# EAGLE design 1 (EAGLE 7.6.0)

## Sheet 1 of 5
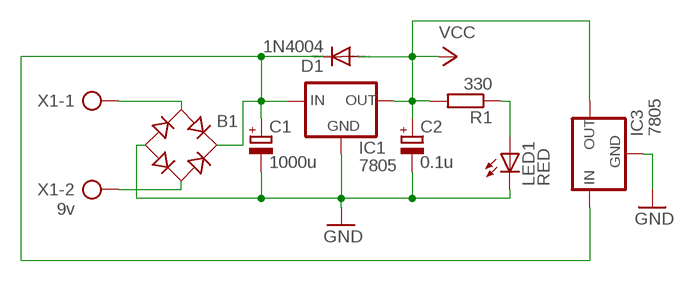
[diagram p0: schematic, sheet 1]

### Parts
B1  RB1A  [RB1A]
C1  1000u  CPOL-EUE3.5-8  [E3,5-8]
C2  0.1u  CPOL-EUE2-5  [E2-5]
D1  1N4004  [DO41-10]
IC1  7805  78XXS  [78XXS]
IC3  7805  78XXS  [78XXS]
LED1  RED  LED5MM  [LED5MM]
R1  330  R-EU_0204/7  [0204/7]
X1  9v  AK500/2  [AK500/2]

### Nets
GND: B1.- C1.- C2.- IC1.GND IC3.GND LED1.K(C) ; also sheet 2,3,4,5
N$1: B1.AC1 X1.1
N$2: B1.AC2 X1.2
N$3: B1.+ C1.+ D1.C IC1.IN IC3.IN
N$5: LED1.A R1.1
VCC: C2.+ D1.A IC1.OUT IC3.OUT R1.2 ; also sheet 2,3,4,5

## Sheet 2 of 5
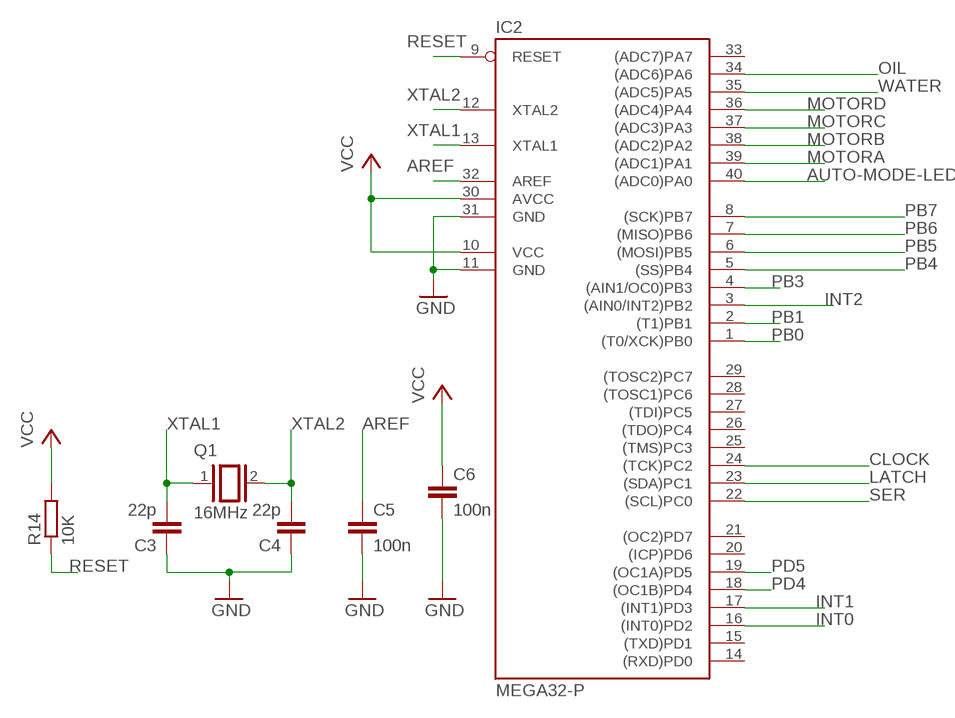
[diagram p1: schematic, sheet 2]

### Parts
C3  22p  C-EU025-024X044  [C025-024X044]
C4  22p  C-EU025-024X044  [C025-024X044]
C5  100n  C-EU025-024X044  [C025-024X044]
C6  100n  C-EU025-024X044  [C025-024X044]
IC2  MEGA32-P  [DIL40]
Q1  16MHz  XTAL  [Q]
R14  10K  R-EU_0204/7  [0204/7]

### Nets
AREF: C5.1 IC2.32(AREF)
AUTO-MODE-LED: IC2.40((ADC0)PA0) ; also sheet 5
CLOCK: IC2.24((TCK)PC2) ; also sheet 3
GND: C3.1 C4.1 C5.2 C6.2 IC2.11(GND) IC2.31(GND) ; also sheet 1,3,4,5
INT0: IC2.16((INT0)PD2) ; also sheet 4
INT1: IC2.17((INT1)PD3) ; also sheet 4
INT2: IC2.3((AIN0/INT2)PB2) ; also sheet 4
LATCH: IC2.23((SDA)PC1) ; also sheet 3
MOTORA: IC2.39((ADC1)PA1) ; also sheet 5
MOTORB: IC2.38((ADC2)PA2) ; also sheet 5
MOTORC: IC2.37((ADC3)PA3) ; also sheet 5
MOTORD: IC2.36((ADC4)PA4) ; also sheet 5
OIL: IC2.34((ADC6)PA6) ; also sheet 5
PB0: IC2.1((T0/XCK)PB0) ; also sheet 4
PB1: IC2.2((T1)PB1) ; also sheet 4
PB3: IC2.4((AIN1/OC0)PB3) ; also sheet 4
PB4: IC2.5((SS)PB4) ; also sheet 4
PB5: IC2.6((MOSI)PB5) ; also sheet 4
PB6: IC2.7((MISO)PB6) ; also sheet 4
PB7: IC2.8((SCK)PB7) ; also sheet 4
PD4: IC2.18((OC1B)PD4) ; also sheet 4
PD5: IC2.19((OC1A)PD5) ; also sheet 4
RESET: IC2.9(RESET) R14.1 ; also sheet 4
SER: IC2.22((SCL)PC0) ; also sheet 3
VCC: C6.1 IC2.10(VCC) IC2.30(AVCC) R14.2 ; also sheet 1,3,4,5
WATER: IC2.35((ADC5)PA5) ; also sheet 5
XTAL1: C3.2 IC2.13(XTAL1) Q1.1
XTAL2: C4.2 IC2.12(XTAL2) Q1.2
Unconnected: IC2.14((RXD)PD0) IC2.15((TXD)PD1) IC2.20((ICP)PD6) IC2.21((OC2)PD7) IC2.25((TMS)PC3) IC2.26((TDO)PC4) IC2.27((TDI)PC5) IC2.28((TOSC1)PC6) IC2.29((TOSC2)PC7) IC2.33((ADC7)PA7)

## Sheet 3 of 5
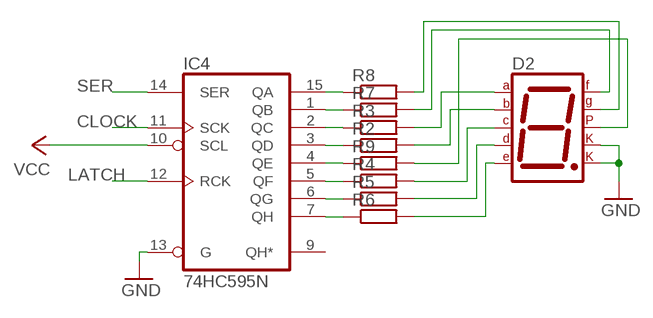
[diagram p2: schematic, sheet 3]

### Parts
D2  7SEG-CK  [7SEG-13]
IC4  74HC595N  [DIL16]
R2  R-EU_0204/7  [0204/7]
R3  R-EU_0204/7  [0204/7]
R4  R-EU_0204/7  [0204/7]
R5  R-EU_0204/7  [0204/7]
R6  R-EU_0204/7  [0204/7]
R7  R-EU_0204/7  [0204/7]
R8  R-EU_0204/7  [0204/7]
R9  R-EU_0204/7  [0204/7]

### Nets
CLOCK: IC4.11(SCK) ; also sheet 2
GND: D2.3(CK1) D2.8(CK2) IC4.13(G) ; also sheet 1,2,4,5
LATCH: IC4.12(RCK) ; also sheet 2
N$4: D2.7(A) R3.2
N$7: D2.6(B) R2.2
N$8: D2.9(F) R7.2
N$9: D2.2(D) R5.2
N$10: D2.1(E) R6.2
N$11: D2.10(G) R8.2
N$13: D2.5(DP) R9.2
N$14: IC4.15(QA) R8.1
N$15: IC4.4(QE) R9.1
N$31: IC4.1(QB) R7.1
N$69: IC4.2(QC) R3.1
N$70: IC4.3(QD) R2.1
N$71: IC4.5(QF) R4.1
N$72: IC4.6(QG) R5.1
N$73: IC4.7(QH) R6.1
N$75: D2.4(C) R4.2
SER: IC4.14(SER) ; also sheet 2
VCC: IC4.10(SCL) ; also sheet 1,2,4,5
Unconnected: IC4.9(QH*)

## Sheet 4 of 5
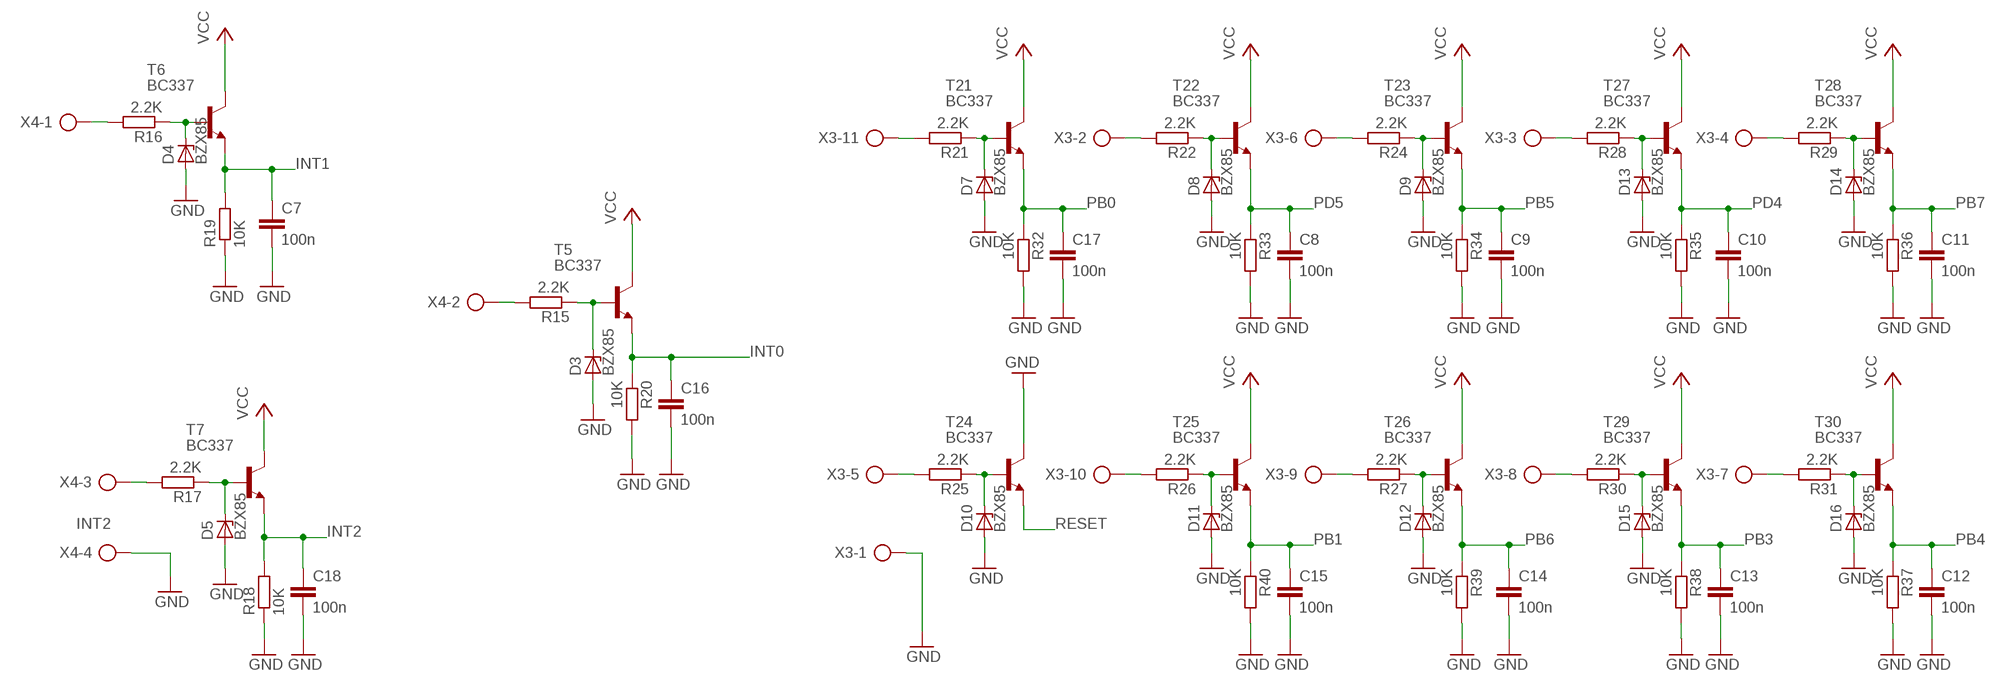
[diagram p3: schematic, sheet 4]

### Parts
C7  100n  C-EU025-024X044  [C025-024X044]
C8  100n  C-EU025-024X044  [C025-024X044]
C9  100n  C-EU025-024X044  [C025-024X044]
C10  100n  C-EU025-024X044  [C025-024X044]
C11  100n  C-EU025-024X044  [C025-024X044]
C12  100n  C-EU025-024X044  [C025-024X044]
C13  100n  C-EU025-024X044  [C025-024X044]
C14  100n  C-EU025-024X044  [C025-024X044]
C15  100n  C-EU025-024X044  [C025-024X044]
C16  100n  C-EU025-024X044  [C025-024X044]
C17  100n  C-EU025-024X044  [C025-024X044]
C18  100n  C-EU025-024X044  [C025-024X044]
D3  BZX85  [DO41Z10]
D4  BZX85  [DO41Z10]
D5  BZX85  [DO41Z10]
D7  BZX85  [DO41Z10]
D8  BZX85  [DO41Z10]
D9  BZX85  [DO41Z10]
D10  BZX85  [DO41Z10]
D11  BZX85  [DO41Z10]
D12  BZX85  [DO41Z10]
D13  BZX85  [DO41Z10]
D14  BZX85  [DO41Z10]
D15  BZX85  [DO41Z10]
D16  BZX85  [DO41Z10]
R15  2.2K  R-EU_0207/10  [0207/10]
R16  2.2K  R-EU_0207/10  [0207/10]
R17  2.2K  R-EU_0207/10  [0207/10]
R18  10K  R-EU_0204/7  [0204/7]
R19  10K  R-EU_0204/7  [0204/7]
R20  10K  R-EU_0204/7  [0204/7]
R21  2.2K  R-EU_0207/10  [0207/10]
R22  2.2K  R-EU_0207/10  [0207/10]
R24  2.2K  R-EU_0207/10  [0207/10]
R25  2.2K  R-EU_0207/10  [0207/10]
R26  2.2K  R-EU_0207/10  [0207/10]
R27  2.2K  R-EU_0207/10  [0207/10]
R28  2.2K  R-EU_0207/10  [0207/10]
R29  2.2K  R-EU_0207/10  [0207/10]
R30  2.2K  R-EU_0207/10  [0207/10]
R31  2.2K  R-EU_0207/10  [0207/10]
R32  10K  R-EU_0204/7  [0204/7]
R33  10K  R-EU_0204/7  [0204/7]
R34  10K  R-EU_0204/7  [0204/7]
R35  10K  R-EU_0204/7  [0204/7]
R36  10K  R-EU_0204/7  [0204/7]
R37  10K  R-EU_0204/7  [0204/7]
R38  10K  R-EU_0204/7  [0204/7]
R39  10K  R-EU_0204/7  [0204/7]
R40  10K  R-EU_0204/7  [0204/7]
T5  BC337  [TO92]
T6  BC337  [TO92]
T7  BC337  [TO92]
T21  BC337  [TO92]
T22  BC337  [TO92]
T23  BC337  [TO92]
T24  BC337  [TO92]
T25  BC337  [TO92]
T26  BC337  [TO92]
T27  BC337  [TO92]
T28  BC337  [TO92]
T29  BC337  [TO92]
T30  BC337  [TO92]
X3  AK500/11  [AK500/11]
X4  AK500/4  [AK500/4]

### Nets
GND: C7.2 C8.2 C9.2 C10.2 C11.2 C12.2 C13.2 C14.2 C15.2 C16.2 C17.2 C18.2 D3.A D4.A D5.A D7.A D8.A D9.A D10.A D11.A D12.A D13.A D14.A D15.A D16.A R18.1 R19.1 R20.2 R32.2 R33.2 R34.2 R35.2 R36.2 R37.2 R38.2 R39.2 R40.2 T24.3(C) X3.1 X4.4 ; also sheet 1,2,3,5
INT0: C16.1 R20.1 T5.1(E) ; also sheet 2
INT1: C7.1 R19.2 T6.1(E) ; also sheet 2
INT2: C18.1 R18.2 T7.1(E) ; also sheet 2
N$6: R21.2 X3.11
N$16: D7.C R21.1 T21.2(B)
N$17: D8.C R22.1 T22.2(B)
N$25: D9.C R24.1 T23.2(B)
N$26: D10.C R25.1 T24.2(B)
N$27: D11.C R26.1 T25.2(B)
N$28: D12.C R27.1 T26.2(B)
N$29: D3.C R15.1 T5.2(B)
N$30: D5.C R17.1 T7.2(B)
N$32: R16.2 X4.1
N$33: R17.2 X4.3
N$34: R15.2 X4.2
N$40: D13.C R28.1 T27.2(B)
N$41: D14.C R29.1 T28.2(B)
N$42: D15.C R30.1 T29.2(B)
N$43: D16.C R31.1 T30.2(B)
N$46: R25.2 X3.5
N$47: R26.2 X3.10
N$48: R27.2 X3.9
N$49: R30.2 X3.8
N$50: R31.2 X3.7
N$51: R29.2 X3.4
N$52: R28.2 X3.3
N$53: R24.2 X3.6
N$54: R22.2 X3.2
N$68: D4.C R16.1 T6.2(B)
PB0: C17.1 R32.1 T21.1(E) ; also sheet 2
PB1: C15.1 R40.1 T25.1(E) ; also sheet 2
PB3: C13.1 R38.1 T29.1(E) ; also sheet 2
PB4: C12.1 R37.1 T30.1(E) ; also sheet 2
PB5: C9.1 R34.1 T23.1(E) ; also sheet 2
PB6: C14.1 R39.1 T26.1(E) ; also sheet 2
PB7: C11.1 R36.1 T28.1(E) ; also sheet 2
PD4: C10.1 R35.1 T27.1(E) ; also sheet 2
PD5: C8.1 R33.1 T22.1(E) ; also sheet 2
RESET: T24.1(E) ; also sheet 2
VCC: T5.3(C) T6.3(C) T7.3(C) T21.3(C) T22.3(C) T23.3(C) T25.3(C) T26.3(C) T27.3(C) T28.3(C) T29.3(C) T30.3(C) ; also sheet 1,2,3,5

## Sheet 5 of 5
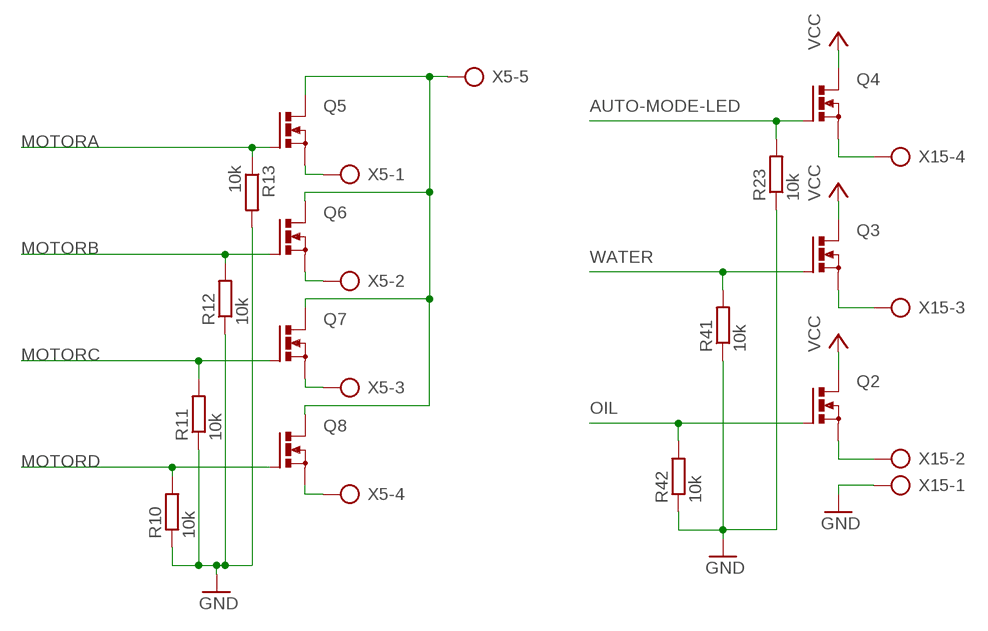
[diagram p4: schematic, sheet 5]

### Parts
Q2  N-MOSFET-SO8S  [SO-08]
Q3  N-MOSFET-SO8S  [SO-08]
Q4  N-MOSFET-SO8S  [SO-08]
Q5  N-MOSFET-SO8S  [SO-08]
Q6  N-MOSFET-SO8S  [SO-08]
Q7  N-MOSFET-SO8S  [SO-08]
Q8  N-MOSFET-SO8S  [SO-08]
R10  10k  R-EU_0204/7  [0204/7]
R11  10k  R-EU_0204/7  [0204/7]
R12  10k  R-EU_0204/7  [0204/7]
R13  10k  R-EU_0204/7  [0204/7]
R23  10k  R-EU_0204/7  [0204/7]
R41  10k  R-EU_0204/7  [0204/7]
R42  10k  R-EU_0204/7  [0204/7]
X5  AK500/5  [AK500/5]
X15  AK500/4  [AK500/4]

### Nets
AUTO-MODE-LED: Q4.4(G) R23.2 ; also sheet 2
GND: R10.1 R11.1 R12.1 R13.2 R23.1 R41.1 R42.1 X15.1 ; also sheet 1,2,3,4
MOTORA: Q5.4(G) R13.1 ; also sheet 2
MOTORB: Q6.4(G) R12.2 ; also sheet 2
MOTORC: Q7.4(G) R11.2 ; also sheet 2
MOTORD: Q8.4(G) R10.2 ; also sheet 2
N$18: Q5.1(S) Q5.2(S) Q5.3(S) X5.1
N$19: Q6.1(S) Q6.2(S) Q6.3(S) X5.2
N$20: Q7.1(S) Q7.2(S) Q7.3(S) X5.3
N$21: Q8.1(S) Q8.2(S) Q8.3(S) X5.4
N$22: Q4.1(S) Q4.2(S) Q4.3(S) X15.4
N$23: Q3.1(S) Q3.2(S) Q3.3(S) X15.3
N$24: Q2.1(S) Q2.2(S) Q2.3(S) X15.2
N$39: Q5.5(D) Q5.6(D) Q5.7(D) Q5.8(D) Q6.5(D) Q6.6(D) Q6.7(D) Q6.8(D) Q7.5(D) Q7.6(D) Q7.7(D) Q7.8(D) Q8.5(D) Q8.6(D) Q8.7(D) Q8.8(D) X5.5
OIL: Q2.4(G) R42.2 ; also sheet 2
VCC: Q2.5(D) Q2.6(D) Q2.7(D) Q2.8(D) Q3.5(D) Q3.6(D) Q3.7(D) Q3.8(D) Q4.5(D) Q4.6(D) Q4.7(D) Q4.8(D) ; also sheet 1,2,3,4
WATER: Q3.4(G) R41.2 ; also sheet 2

## Power pins joined to a net without a drawn wire
GND: IC4.8(GND)
VCC: IC4.16(VCC)

## Library data of the parts
B1 = rectifier:RB1A: RECTIFIER 1 A
C1 C2 = rcl:CPOL-EU: POLARIZED CAPACITOR, European symbol
C3-C18 = rcl:C-EU: CAPACITOR, European symbol
D1 = diode:1N4004: DIODE general purpose rectifier, 1 A
D2 = special:7SEG-CK: 7-segment DISPLAY single cathode, 13 mm
D3-D5 D7-D16 = diode:BZX85: Z DIODE
IC1 IC3 = v-reg:78XXS: VOLTAGE REGULATOR
IC2 = atmel:MEGA32-P: MICROCONTROLLER 32 Kbytes FLASH 2 Kbytes SRAM 1 Kbytes EEPROM USART 8-channel 10 bit ADC Source: www.atmel.com .. doc2503.pdf; MPN: ATMEGA32-16PU; OC_FARNELL: 1661729; OC_NEWARK: 51P1794
IC4 = 74xx-eu:74*595: 8-bit SHIFT REGISTER, output latch
LED1 = led:LED: LED OSRAM: - CHIPLED LG R971, LG N971, LY N971, LG Q971, LY Q971, LO R971, LY R971 LH N974, LH R974 LS Q976, LO Q976, LY Q976 LO Q996 - Hyper CHIPLED LW Q18S LB Q993, LB Q99A, LB R99A - SideLED LS A670, LO A670, LY A670, LG A670, LP A670 LB A673, LV A673, LT A673, LW A673 LH A674 LY A675 LS A676, LA A676, LO A676, LY A676, LW A676 LS A679, LY A679, LG A679 - Hyper Micro SIDELED® LS Y876, LA Y876, LO Y876, LY Y876 LT Y87S - SmartLED LW L88C, LW L88S LB L89C, LB L89S, LG L890 LS L89K, LO L89K, LY L89K LS L896, LA L896, LO L896, LY L896 - TOPLED LS T670, LO T670, LY T670, LG T670, LP T670 LSG T670, LSP T670, LSY T670, LOP T670, LYG T670 LG T671, LOG T671, LSG T671 LB T673, LV T673, LT T673, LW T673 LH T674 LS T676, LA T676, LO T676, LY T676, LB T676, LH T676, LSB T676, LW T676 LB T67C, LV T67C, LT T67C, LS T67K, LO T67K, LY T67K, LW E67C LS E67B, LA E67B, LO E67B, LY E67B, LB E67C, LV E67C, LT E67C LW T67C LS T679, LY T679, LG T679 LS T770, LO T770, LY T770, LG T770, LP T770 LB T773, LV T773, LT T773, LW T773 LH T774 LS E675, LA E675, LY E675, LS T675 LS T776, LA T776, LO T776, LY T776, LB T776 LHGB T686 LT T68C, LB T68C - Hyper Mini TOPLED® LB M676 - Mini TOPLED Santana® LG M470 LS M47K, LO M47K, LY M47K Source: http://www.osram.convergy.de LUXEON: - LUMILED® LXK2-PW12-R00, LXK2-PW12-S00, LXK2-PW14-U00, LXK2-PW14-V00 LXK2-PM12-R00, LXK2-PM12-S00, LXK2-PM14-U00 LXK2-PE12-Q00, LXK2-PE12-R00, LXK2-PE12-S00, LXK2-PE14-T00, LXK2-PE14-U00 LXK2-PB12-K00, LXK2-PB12-L00, LXK2-PB12-M00, LXK2-PB14-N00, LXK2-PB14-P00, LXK2-PB14-Q00 LXK2-PR12-L00, LXK2-PR12-M00, LXK2-PR14-Q00, LXK2-PR14-R00 LXK2-PD12-Q00, LXK2-PD12-R00, LXK2-PD12-S00 LXK2-PH12-R00, LXK2-PH12-S00 LXK2-PL12-P00, LXK2-PL12-Q00, LXK2-PL12-R00 Source: www.luxeon.com KINGBRIGHT: KA-3528ASYC Source: www.kingbright.com
Q1 = special:XTAL: CRYSTAL
Q2-Q8 = transistor-power:N-MOSFET-SO8: N-Channel MOSFET Example: FDS7760A; N-Channel Logic Level PowerTrench® MOSFET FDS2572; N-Channel UltraFET® Trench MOSFET Source: www.fairchildsemi.com
R1-R42 = rcl:R-EU_: RESISTOR, European symbol
T5-T7 T21-T30 = transistor:BC337: NPN TRANSISTOR
X1 = con-ptr500:AK500/2: CONNECTOR; OC_FARNELL: unknown; OC_NEWARK: unknown
X3 = con-ptr500:AK500/11: CONNECTOR; OC_FARNELL: unknown; OC_NEWARK: unknown
X4 X15 = con-ptr500:AK500/4: CONNECTOR; OC_FARNELL: unknown; OC_NEWARK: unknown
X5 = con-ptr500:AK500/5: CONNECTOR; OC_FARNELL: unknown; OC_NEWARK: unknown

## Board
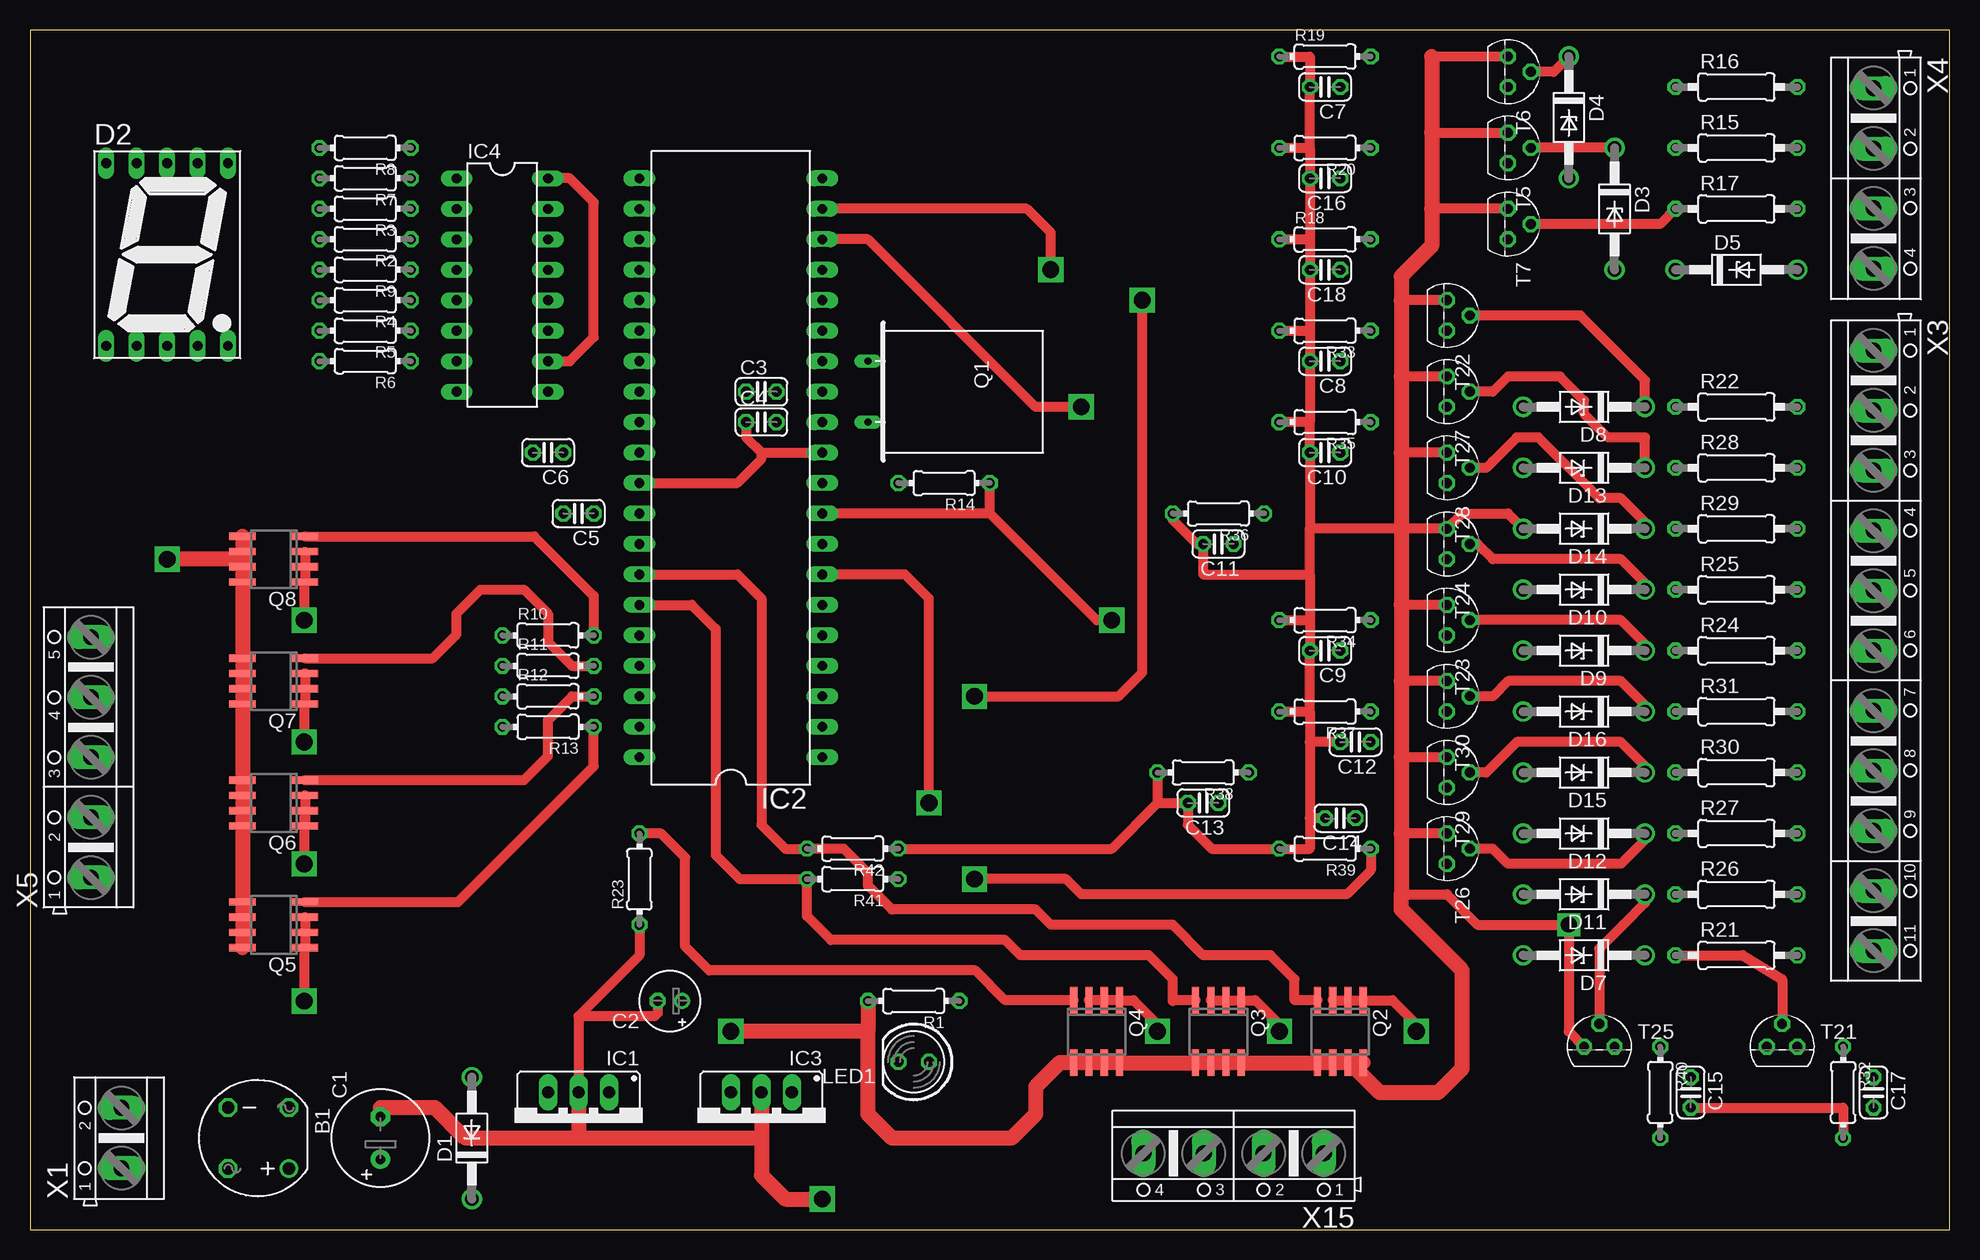
[diagram p5: board, top side]
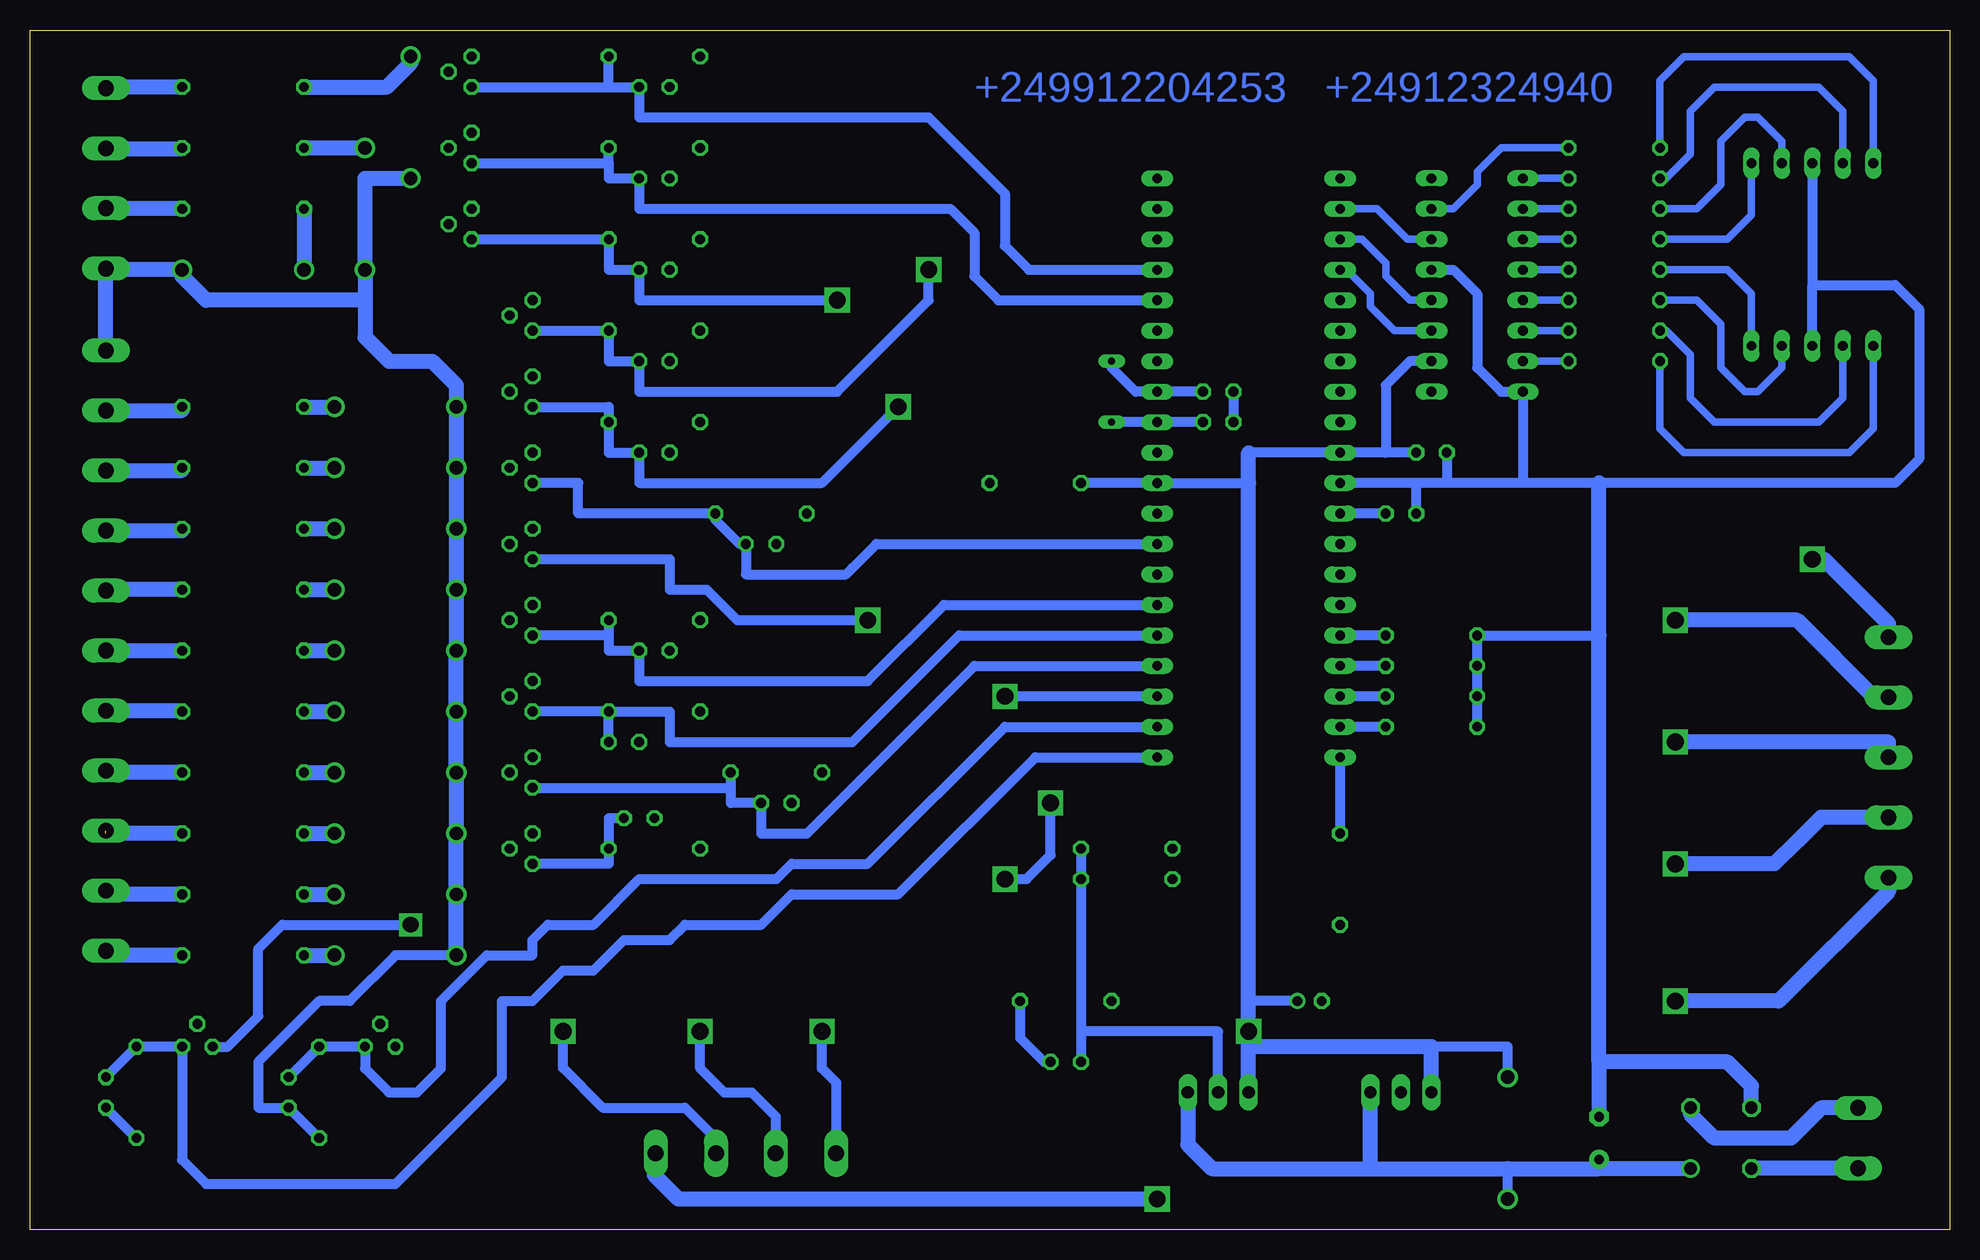
[diagram p6: board, bottom side, seen from below]

Size 160 x 100 mm. Coordinates in mm from the lower left corner, seen from the top.
Outline: 0,0 160,0 160,100 0,100 0,0
Copper layers (1*16): Top 0.035mm / dielectric 1.5mm / Bottom 0.035mm
Design rules "default": minimum track width 10mil, minimum drill 24mil, track to track 8mil, track to pad 8mil, pad to pad 8mil, via to via 8mil, smd to smd 8mil, copper to edge 40mil, drill to drill 8mil, minimum pad ring 10mil, minimum via ring 8mil, stop-mask expansion 4mil, vias tented up to drill 0mil, thermal gap 10mil

### Footprints (pad centres in the part's own frame; a part is rotated, then mirrored left to right if it is on the bottom)
RB1A = drill 1.016: + -2.54,2.54 | drill 1.016 octagon: - 2.54,-2.54; AC1 2.54,2.54; AC2 -2.54,-2.54
E3,5-8 = drill 0.813 pad 1.6: + -1.778,0 | drill 0.813 pad 1.6 octagon: - 1.778,0
E2-5 = drill 0.813 pad 1.27: + -1.016,0 | drill 0.813 pad 1.27 octagon: - 1.016,0
C025-024X044 = drill 0.813 octagon: 1 -1.27,0; 2 1.27,0
DO41-10 = drill 1.118: A 5.08,0; C -5.08,0
7SEG-13 = drill 0.813 long: 1 -5.08,-7.62; 2 -2.54,-7.62; 3 0,-7.62; 4 2.54,-7.62; 5 5.08,-7.62; 6 5.08,7.62; 7 2.54,7.62; 8 0,7.62; 9 -2.54,7.62; 10 -5.08,7.62
DO41Z10 = drill 1.118: A 5.08,0; C -5.08,0
78XXS = drill 1.016 long: GND 0,-2.54; IN -2.54,-2.54; OUT 2.54,-2.54
DIL40 = drill 0.813 long: 1 -24.13,-7.62; 2 -21.59,-7.62; 3 -19.05,-7.62; 4 -16.51,-7.62; 5 -13.97,-7.62; 6 -11.43,-7.62; 7 -8.89,-7.62; 8 -6.35,-7.62; 9 -3.81,-7.62; 10 -1.27,-7.62; 11 1.27,-7.62; 12 3.81,-7.62; 13 6.35,-7.62; 14 8.89,-7.62; 15 11.43,-7.62; 16 13.97,-7.62; 17 16.51,-7.62; 18 19.05,-7.62; 19 21.59,-7.62; 20 24.13,-7.62; 21 24.13,7.62; 22 21.59,7.62; 23 19.05,7.62; 24 16.51,7.62; 25 13.97,7.62; 26 11.43,7.62; 27 8.89,7.62; 28 6.35,7.62; 29 3.81,7.62; 30 1.27,7.62; 31 -1.27,7.62; 32 -3.81,7.62; 33 -6.35,7.62; 34 -8.89,7.62; 35 -11.43,7.62; 36 -13.97,7.62; 37 -16.51,7.62; 38 -19.05,7.62; 39 -21.59,7.62; 40 -24.13,7.62
DIL16 = drill 0.813 long: 1 -8.89,-3.81; 2 -6.35,-3.81; 3 -3.81,-3.81; 4 -1.27,-3.81; 5 1.27,-3.81; 6 3.81,-3.81; 7 6.35,-3.81; 8 8.89,-3.81; 9 8.89,3.81; 10 6.35,3.81; 11 3.81,3.81; 12 1.27,3.81; 13 -1.27,3.81; 14 -3.81,3.81; 15 -6.35,3.81; 16 -8.89,3.81
LED5MM = drill 0.813 octagon: A -1.27,0; K 1.27,0
Q = drill 0.61 long: 1 -2.54,-7.62; 2 2.54,-7.62
SO-08 = smd 0.6 x 2.2: 1 -1.905,-2.6; 2 -0.635,-2.6; 3 0.635,-2.6; 4 1.905,-2.6; 5 1.905,2.6; 6 0.635,2.6; 7 -0.635,2.6; 8 -1.905,2.6
0204/7 = drill 0.813 octagon: 1 -3.81,0; 2 3.81,0
0207/10 = drill 0.813 octagon: 1 -5.08,0; 2 5.08,0
TO92 = drill 0.813 octagon: 1 1.27,0; 2 0,1.905; 3 -1.27,0
AK500/2 = drill 1.321 long: 1 -2.515,0; 2 2.515,0
AK500/11 = drill 1.321 long: 1 -25.019,0; 2 -20.015,0; 3 -15.011,0; 4 -10.008,0; 5 -5.004,0; 6 0,0; 7 5.004,0; 8 10.008,0; 9 15.011,0; 10 20.015,0; 11 25.019,0
AK500/4 = drill 1.321 long: 1 -7.518,0; 2 -2.489,0; 3 2.489,0; 4 7.518,0
AK500/5 = drill 1.321 long: 1 -10.033,0; 2 -5.004,0; 3 0,0; 4 5.004,0; 5 10.008,0

### Placement (x,y rotation side)
B1  19.05,7.62 180 top
C1  29.21,7.62 90 top
C2  53.34,19.05 180 top
C3  60.96,69.85 0 top
C4  60.96,67.31 0 top
C5  45.72,59.69 180 top
C6  43.18,64.77 180 top
C7  107.95,95.25 180 top
C8  107.95,72.39 180 top
C9  107.95,48.26 180 top
C10  107.95,64.77 180 top
C11  99.06,57.15 180 top
C12  110.49,40.64 180 top
C13  97.79,35.56 180 top
C14  109.22,34.29 180 top
C15  138.43,11.43 270 top
C16  107.95,87.63 180 top
C17  153.67,11.43 270 top
C18  107.95,80.01 180 top
D1  36.83,7.62 90 top
D2  11.43,81.28 0 top
D3  132.08,85.09 270 top
D4  128.27,92.71 270 top
D5  142.24,80.01 0 top
D7  129.54,22.86 180 top
D8  129.54,68.58 180 top
D9  129.54,48.26 180 top
D10  129.54,53.34 180 top
D11  129.54,27.94 180 top
D12  129.54,33.02 180 top
D13  129.54,63.5 180 top
D14  129.54,58.42 180 top
D15  129.54,38.1 180 top
D16  129.54,43.18 180 top
IC1  45.72,8.89 180 top
IC2  58.42,63.5 90 top
IC3  60.96,8.89 180 top
IC4  39.37,78.74 270 top
LED1  73.66,13.97 180 top
Q1  77.47,69.85 270 top
Q2  109.22,16.51 180 top
Q3  99.06,16.51 180 top
Q4  88.9,16.51 180 top
Q5  20.32,25.4 90 top
Q6  20.32,35.56 90 top
Q7  20.32,45.72 90 top
Q8  20.32,55.88 90 top
R1  73.66,19.05 180 top
R2  27.94,82.55 180 top
R3  27.94,85.09 180 top
R4  27.94,77.47 180 top
R5  27.94,74.93 180 top
R6  27.94,72.39 180 top
R7  27.94,87.63 180 top
R8  27.94,90.17 180 top
R9  27.94,80.01 180 top
R10  43.18,49.53 0 top
R11  43.18,46.99 0 top
R12  43.18,44.45 0 top
R13  43.18,41.91 180 top
R14  76.2,62.23 180 top
R15  142.24,90.17 0 top
R16  142.24,95.25 0 top
R17  142.24,85.09 0 top
R18  107.95,82.55 0 top
R19  107.95,97.79 0 top
R20  107.95,90.17 180 top
R21  142.24,22.86 0 top
R22  142.24,68.58 0 top
R23  50.8,29.21 90 top
R24  142.24,48.26 0 top
R25  142.24,53.34 0 top
R26  142.24,27.94 0 top
R27  142.24,33.02 0 top
R28  142.24,63.5 0 top
R29  142.24,58.42 0 top
R30  142.24,38.1 0 top
R31  142.24,43.18 0 top
R32  151.13,11.43 270 top
R33  107.95,74.93 180 top
R34  107.95,50.8 180 top
R35  107.95,67.31 180 top
R36  99.06,59.69 180 top
R37  107.95,43.18 180 top
R38  97.79,38.1 180 top
R39  107.95,31.75 180 top
R40  135.89,11.43 270 top
R41  68.58,29.21 180 top
R42  68.58,31.75 180 top
T5  123.19,90.17 270 top
T6  123.19,96.52 270 top
T7  123.19,83.82 270 top
T21  146.05,15.24 0 top
T22  118.11,76.2 270 top
T23  118.11,50.8 270 top
T24  118.11,57.15 270 top
T25  130.81,15.24 0 top
T26  118.11,31.75 270 top
T27  118.11,69.85 270 top
T28  118.11,63.5 270 top
T29  118.11,38.1 270 top
T30  118.11,44.45 270 top
X1  7.62,7.62 90 top
X3  153.67,48.26 270 top
X4  153.67,87.63 270 top
X5  5.08,39.37 90 top
X15  100.33,6.35 180 top

### Tracks (layer width: path | path; a pad name or v marks a point on that pad's centre or on a via)
AREF
  Bottom 0.813: C5.1 IC2.32
AUTO-MODE-LED
  Top 0.813: Q4.4 81.28,19.11 78.8,21.59 56.61,21.59 54.61,23.59 54.61,31.02 52.61,33.02 R23.2
  Bottom 0.813: IC2.40 R23.2
CLOCK
  Bottom 0.61: IC2.24 50.26,80.01 48.26,78.01 48.26,76.93 46.26,74.93 IC4.11
GND  (via drill 1.4)
  Top 0.813: IC2.31 58.96,62.23 60.96,64.23 60.96,64.77 | 60.96,64.77 IC2.11 | C4.1 59.69,66.04 60.96,64.77 | R23.1 50.8,22.86 45.72,17.78 | 45.72,17.78 IC1.GND | R19.1 106.68,97.79 C7.2 106.68,90.17 | R20.2 106.68,90.17 | 106.68,90.17 C16.2 106.68,82.55 | R18.1 106.68,82.55 | 106.68,82.55 C18.2 106.68,74.93 | R33.2 106.68,74.93 | 106.68,74.93 C8.2 106.68,67.31 | 106.68,67.31 R35.2 | 106.68,67.31 C10.2 106.68,58.42 | R37.2 106.68,43.18 | 106.68,43.18 C9.2 106.68,50.8 | 106.68,54.61 106.68,58.42 | 106.68,58.42 T24.3 119.38,59.69 123.19,59.69 D14.A | R36.2 95.25,59.15 97.25,57.15 C11.2 97.79,54.61 106.68,54.61 | 106.68,54.61 106.68,50.8 | R34.2 106.68,50.8 | R38.2 93.98,35.56 | 93.98,35.56 C13.2 96.52,33.75 98.52,31.75 R39.2 106.68,31.75 106.68,34.29 | 106.68,43.18 106.68,40.64 | C12.2 106.68,40.64 | 106.68,40.64 106.68,34.29 | C14.2 106.68,34.29 | C15.2 151.13,10.16 R32.2 | C2.- 52.32,18.03 52.07,17.78 45.72,17.78 | R42.1 90.17,31.75 93.98,35.56
  Top 1.27: IC1.GND 45.72,7.62 | 45.72,7.62 36.29,7.62 33.75,10.16 29.21,10.16 C1.- | IC3.GND 60.96,7.62 | 60.96,7.62 45.72,7.62 | 60.96,7.62 60.96,4.54 62.96,2.54 v66.04,2.54
  Bottom 0.813: D2.8 11.43,78.74 | D2.3 11.43,78.74 | 11.43,78.74 4.54,78.74 2.54,76.74 2.54,64.23 4.54,62.23 29.21,62.23 35.56,62.23 | 35.56,62.23 41.91,62.23 | 41.91,62.23 44.45,62.23 | 44.45,62.23 IC2.31 | R13.2 R12.1 R11.1 R10.1 29.21,49.53 | IC4.13 41.37,80.01 39.37,78.01 39.37,71.85 37.37,69.85 IC4.8 35.56,62.23 | C5.2 44.45,62.23 | C6.2 41.91,62.23 | C3.1 C4.1 | R42.1 R41.1 72.39,16.51 | 72.39,16.51 LED1.K | R40.2 C15.2 140.97,10.16 140.97,13.97 135.89,19.05 133.35,19.05 129.54,22.86 D7.A | C17.2 R32.2 | IC3.GND 60.96,16.51 72.39,16.51
  Bottom 1.27: B1.- 16.51,11.97 18.51,13.97 29.21,13.97 | 29.21,13.97 C1.- | 29.21,13.97 29.21,49.53 29.21,62.23 | v66.04,2.54 105.95,2.54 107.95,4.54 107.95,6.35 X15.1 | D4.A 132.08,87.63 D3.A 132.08,77.47 | 132.08,77.47 145.32,77.47 147.32,79.47 D5.A 153.67,80.01 X4.4 X3.1 | 132.08,77.47 132.08,74.39 130.08,72.39 126.46,72.39 124.46,70.39 D8.A D13.A D14.A D10.A D9.A D16.A D15.A D12.A D11.A D7.A
INT0
  Bottom 0.813: T5.1 111.76,88.9 | 111.76,88.9 R20.1 | 111.76,88.9 111.76,87.63 C16.1 109.22,85.09 83.28,85.09 81.28,83.09 81.28,79.47 79.28,77.47 IC2.16
INT1
  Bottom 0.813: T6.1 111.76,95.25 | 111.76,95.25 R19.2 | 111.76,95.25 C7.1 109.22,92.71 85.09,92.71 78.74,86.36 78.74,82.01 76.74,80.01 IC2.17
INT2  (via drill 1.4)
  Top 0.813: v78.74,44.45 90.71,44.45 92.71,46.45 v92.71,77.47
  Bottom 0.813: T7.1 R18.2 111.76,80.01 C18.1 109.22,77.47 v92.71,77.47 | IC2.3 v78.74,44.45
LATCH
  Bottom 0.61: IC2.23 48.99,82.55 46.99,80.55 46.99,79.47 44.99,77.47 IC4.12
MOTORA
  Top 0.813: Q5.4 35.68,27.3 46.99,38.61 R13.1
  Bottom 0.813: R13.1 IC2.39
MOTORB
  Top 0.813: Q6.4 41.18,37.47 43.18,39.47 43.18,42.45 45.18,44.45 R12.2
  Bottom 0.813: R12.2 IC2.38
MOTORC
  Top 0.813: Q7.4 33.56,47.62 35.56,49.62 35.56,51.34 37.56,53.34 41.18,53.34 43.18,51.34 43.18,48.99 45.18,46.99 R11.2
  Bottom 0.813: R11.2 IC2.37
MOTORD
  Top 0.813: Q8.4 42.03,57.78 46.99,52.83 R10.2
  Bottom 0.813: R10.2 IC2.36
N$1
  Bottom 1.27: X1.1 16.51,5.11 B1.AC1
N$2
  Bottom 1.27: X1.2 10.7,10.13 12.7,8.13 13.21,7.62 19.59,7.62 21.59,9.62 B1.AC2
N$3
  Bottom 0.813: D1.C 36.83,5.08
  Bottom 1.27: B1.+ 29.21,5.08 | IC3.IN 63.5,7.08 61.5,5.08 48.26,5.08 | 48.26,5.08 IC1.IN | 48.26,5.08 36.83,5.08 29.21,5.08 | 29.21,5.08 C1.+
N$4
  Bottom 0.61: R3.2 21.05,85.09 19.05,87.09 19.05,90.71 17.05,92.71 15.97,92.71 13.97,90.71 D2.7
N$5
  Bottom 0.813: R1.1 77.47,15.97 75.47,13.97 LED1.A
N$6
  Bottom 1.27: R21.2 153.67,22.86 X3.11
N$7
  Bottom 0.61: R2.2 18.51,82.55 16.51,84.55 D2.6
N$8
  Bottom 0.61: R7.2 23.59,87.63 21.59,89.63 21.59,93.25 19.59,95.25 10.89,95.25 8.89,93.25 D2.9
N$9
  Bottom 0.61: R5.2 23.59,74.93 21.59,72.93 21.59,69.31 19.59,67.31 10.89,67.31 8.89,69.31 D2.2
N$10
  Bottom 0.61: R6.2 24.13,66.77 22.13,64.77 8.35,64.77 6.35,66.77 D2.1
N$11
  Bottom 0.61: R8.2 24.13,95.79 22.13,97.79 8.35,97.79 6.35,95.79 D2.10
N$12  (via drill 1.4)
  other vias: 93.98,16.51
N$13
  Bottom 0.61: R9.2 18.51,80.01 16.51,78.01 D2.5
N$14
  Bottom 0.61: R8.1 37.37,90.17 39.37,88.17 39.37,87.09 41.37,85.09 IC4.15
N$15
  Bottom 0.61: IC4.4 R9.1
N$16
  Top 0.813: R21.1 142.78,22.86 146.05,20.86 T21.2
  Bottom 1.27: R21.1 D7.C
N$17
  Top 0.813: D8.C 134.62,70.81 129.23,76.2 T22.2
  Bottom 1.27: R22.1 D8.C
N$18  (via drill 1.4)
  Top 0.813: Q5.3 Q5.2 Q5.1 22.86,23.5 v22.86,19.05
  Bottom 1.27: X5.1 5.08,28.21 14.24,19.05 v22.86,19.05
N$19  (via drill 1.4)
  Top 0.813: Q6.3 Q6.2 | Q6.2 Q6.1 | Q6.2 22.86,34.92 v22.86,30.48
  Bottom 1.27: X5.2 10.7,34.37 12.7,32.37 14.59,30.48 v22.86,30.48
N$20  (via drill 1.4)
  Top 0.813: Q7.3 Q7.2 Q7.1 22.86,43.81 v22.86,40.64
  Bottom 1.27: X5.3 5.08,40.64 v22.86,40.64
N$21  (via drill 1.4)
  Top 0.813: Q8.3 Q8.2 Q8.1 22.86,53.98 v22.86,50.8
  Bottom 1.27: X5.4 6.27,44.37 12.7,50.8 v22.86,50.8
N$22  (1 unrouted)
  Top 0.813: Q4.3 Q4.2 Q4.1 91.98,19.11 93.98,17.11 93.98,16.51
  Bottom 0.813: 93.98,16.51 93.98,13.43 92.81,12.26 X15.4
N$23  (1 unrouted)
  Top 0.813: Q3.1 Q3.2 Q3.3 102.14,19.11 104.14,17.11 104.14,16.51
  Bottom 0.813: X15.3 97.84,9.43 99.84,11.43 102.14,11.43 104.14,13.43 104.14,16.51
N$24  (1 unrouted)
  Top 0.813: Q2.1 Q2.2 Q2.3 113.57,19.11 115.57,17.11 115.57,16.51
  Bottom 0.813: 115.57,16.51 115.57,13.47 112.26,10.16 105.41,10.16 102.87,7.62 102.87,6.4 X15.2
N$25
  Top 0.813: D9.C 134.62,48.8 132.62,50.8 T23.2
  Bottom 1.27: R24.1 D9.C
N$26
  Top 0.813: D10.C 134.62,53.88 132.62,55.88 121.92,55.88 120.65,57.15 T24.2
  Bottom 1.27: R25.1 D10.C
N$27
  Top 0.813: D11.C 134.62,27.21 132.81,25.4 130.81,23.4 T25.2
  Bottom 1.27: R26.1 D11.C
N$28
  Top 0.813: T26.2 121.92,31.75 123.19,30.48 132.62,30.48 134.62,32.48 D12.C
  Bottom 1.27: R27.1 D12.C
N$29
  Top 0.813: D3.C T5.2
  Bottom 1.27: R15.1 D3.C
N$30
  Top 0.813: R17.1 135.89,83.82 T7.2
  Bottom 1.27: R17.1 D5.C
N$31
  Bottom 0.61: IC4.1 R7.1
N$32
  Bottom 1.27: R16.2 153.67,95.25 X4.1
N$33
  Bottom 1.27: R17.2 153.67,85.09 X4.3
N$34
  Bottom 1.27: X4.2 147.32,90.12 R15.2
N$35  (via drill 1.4)
  other vias: 104.14,16.51
N$36  (via drill 1.4)
  other vias: 115.57,16.51
N$39  (via drill 1.4)
  Top 1.27: Q8.5 Q8.6 17.72,55.88 | 17.72,55.88 Q8.7 Q8.8 Q7.5 Q7.6 Q7.7 Q7.8 Q6.5 Q6.6 Q6.7 Q6.8 Q5.5 Q5.6 Q5.7 Q5.8 | 17.72,55.88 v11.43,55.88
  Bottom 1.27: X5.5 5.08,50.49 10.47,55.88 v11.43,55.88
N$40
  Top 0.813: D13.C 134.62,66.04 131.54,66.04 129.54,68.04 129.54,69.12 127.54,71.12 123.19,71.12 121.92,69.85 T27.2
  Bottom 1.27: R28.1 D13.C
N$41
  Top 0.813: D14.C 134.62,58.96 132.62,60.96 130.81,60.96 125.73,66.04 123.92,66.04 121.92,64.04 121.38,63.5 T28.2
  Bottom 1.27: R29.1 D14.C
N$42
  Top 0.813: D15.C 134.62,38.64 132.62,40.64 123.92,40.64 121.92,38.64 121.38,38.1 T29.2
  Bottom 1.27: R30.1 D15.C
N$43
  Top 0.813: D16.C 134.62,43.72 132.62,45.72 123.19,45.72 121.92,44.45 T30.2
  Bottom 1.27: R31.1 D16.C
N$46
  Bottom 1.27: R25.2 153.67,53.34 X3.5
N$47
  Bottom 1.27: R26.2 153.67,27.94 X3.10
N$48  (1 unrouted)
  Bottom 1.27: R27.2 153.67,33.02
N$49
  Bottom 1.27: R30.2 153.67,38.1 X3.8
N$50
  Bottom 1.27: X3.7 147.32,43.26 R31.2
N$51
  Bottom 1.27: X3.4 147.32,58.27 R29.2
N$52
  Bottom 1.27: X3.3 147.32,63.27 R28.2
N$53
  Bottom 1.27: X3.6 R24.2
N$54
  Bottom 1.27: X3.2 147.32,68.28 R22.2
N$68
  Top 0.813: D4.C 127,96.52 T6.2
  Bottom 1.27: R16.1 130.27,95.25 128.27,97.25 D4.C
N$69
  Bottom 0.61: IC4.2 R3.1
N$70
  Bottom 0.61: IC4.3 R2.1
N$71
  Bottom 0.61: IC4.5 R4.1
N$72
  Bottom 0.61: IC4.6 R5.1
N$73
  Bottom 0.61: IC4.7 R6.1
N$75
  Bottom 0.61: R4.2 21.05,77.47 19.05,75.47 19.05,71.85 17.05,69.85 15.97,69.85 13.97,71.85 D2.4
OIL
  Top 0.813: IC2.34 58.96,54.61 60.96,52.61 60.96,33.75 62.96,31.75 R42.2 67.85,31.75 69.85,29.75 69.85,28.67 71.85,26.67 83.82,26.67 85.09,25.4 95.25,25.4 97.79,22.86 103.41,22.86 105.41,20.86 105.41,19.11 Q2.4
PB0
  Bottom 0.813: C17.1 R32.1 T21.1 147.32,5.81 145.32,3.81 129.54,3.81 120.65,12.7 120.65,19.05 118.11,19.05 115.57,21.59 113.03,21.59 110.49,24.13 106.68,24.13 105.41,25.4 99.06,25.4 96.52,27.94 87.63,27.94 76.2,39.37 IC2.1
PB1
  Bottom 0.813: C15.1 R40.1 T25.1 132.08,13.43 130.08,11.43 127.73,11.43 125.73,13.43 125.73,19.05 121.92,22.86 118.11,22.86 118.11,24.13 116.84,25.4 113.03,25.4 109.22,29.21 97.79,29.21 96.52,30.48 90.17,30.48 78.74,41.91 IC2.2
PB3
  Bottom 0.813: R38.1 101.6,36.83 | 101.6,36.83 101.6,35.56 C13.1 99.06,33.02 95.25,33.02 81.28,46.99 IC2.4 | T29.1 101.6,36.83
PB4
  Bottom 0.813: R37.1 T30.1 | C12.1 R37.1 | R37.1 106.68,43.18 106.68,40.64 91.44,40.64 82.55,49.53 IC2.5
PB5
  Bottom 0.813: 111.76,49.53 111.76,48.26 C9.1 109.22,45.72 90.17,45.72 83.82,52.07 IC2.6 | R34.1 111.76,49.53 | 111.76,49.53 T23.1
PB6  (via drill 1.4)
  Top 0.813: R39.1 111.76,29.94 109.76,27.94 87.63,27.94 86.36,29.21 v78.74,29.21 | v74.93,35.56 74.93,52.61 72.93,54.61 IC2.7
  Bottom 0.813: T26.1 111.76,30.48 R39.1 111.76,34.29 C14.1 | v78.74,29.21 76.93,29.21 74.93,31.21 v74.93,35.56
PB7
  Bottom 0.813: T28.1 114.3,62.23 114.3,59.69 R36.1 102.87,59.15 100.87,57.15 C11.1 100.33,54.61 91.98,54.61 91.44,55.15 89.44,57.15 IC2.8
PD4  (via drill 1.4)
  Top 0.813: v87.63,68.58 83.82,68.58 69.85,82.55 IC2.18
  Bottom 0.813: T27.1 111.76,68.58 R35.1 111.76,64.77 C10.1 109.22,62.23 93.98,62.23 v87.63,68.58
PD5  (via drill 1.4)
  Top 0.813: v85.09,80.01 85.09,83.09 83.09,85.09 IC2.19
  Bottom 0.813: T22.1 R33.1 111.76,72.39 C8.1 109.22,69.85 92.71,69.85 85.09,77.47 v85.09,80.01
RESET  (via drill 1.4)
  Top 0.813: 80.01,59.69 IC2.9 | v90.17,50.8 88.9,50.8 80.01,59.69 | 80.01,59.69 R14.1
  Bottom 0.813: T24.1 106.68,55.88 106.68,53.34 103.6,53.34 101.06,50.8 v90.17,50.8
SER
  Bottom 0.61: IC2.22 47.72,85.09 45.18,82.55 IC4.14
VCC  (via drill 1.3, 1.4)
  Top 0.813: IC4.10 44.99,72.39 46.99,74.39 46.99,85.63 44.99,87.63 IC4.16 | 116.84,91.44 T5.3 | T6.3 116.84,97.79 | T7.3 116.84,85.09 | T26.3 114.3,33.02 | T29.3 114.3,39.37 | T30.3 114.3,45.72 | T23.3 114.3,52.07 | T28.3 114.3,64.77 | T27.3 114.3,71.12 | T22.3 114.3,77.47 | 114.3,27.94 118.11,27.94 120.65,25.4 v128.27,25.4 128.27,16.51 T25.3
  Top 1.27: 69.85,16.51 69.85,9.62 71.85,7.62 81.82,7.62 83.82,9.62 83.82,11.91 85.82,13.91 Q4.5 Q4.6 Q4.7 Q4.8 Q3.5 Q3.6 Q3.7 Q3.8 Q2.5 Q2.6 Q2.7 Q2.8 110.49,13.91 110.49,13.43 112.49,11.43 117.38,11.43 119.38,13.43 119.38,21.59 114.3,26.67 114.3,27.94 114.3,33.02 114.3,39.37 114.3,45.72 114.3,52.07 114.3,64.77 114.3,71.12 114.3,77.47 114.3,79.47 114.84,80.01 116.84,82.01 116.84,85.09 116.84,91.44 116.84,97.79 | R1.2 69.85,16.51 | 69.85,16.51 v58.42,16.51
  Bottom 0.813: 58.42,64.77 IC2.30 46.99,64.77 | 58.42,62.23 IC2.10 R14.2 | 58.42,18.8 58.42,19.05 C2.+ | IC4.10 44.99,72.39 46.99,70.39 46.99,64.77 | C6.1 46.99,64.77 | D1.A 36.83,15.24 44.45,15.24 | T21.3 143.51,15.24 140.97,17.78 140.97,23.4 138.97,25.4 v128.27,25.4
  Bottom 1.27: IC1.OUT 43.18,15.24 44.45,15.24 58.42,15.24 | IC3.OUT 58.42,15.24 | 58.42,15.24 v58.42,16.51 58.42,19.05 58.42,62.23 58.42,64.77
WATER
  Top 0.813: IC2.35 55.15,52.07 57.15,50.07 57.15,31.21 59.15,29.21 R41.2 64.77,26.13 66.77,24.13 81.28,24.13 82.55,22.86 93.25,22.86 95.25,20.86 95.25,19.11 | Q3.4 95.25,19.11 | 95.25,19.11 95.25,19.05
XTAL1
  Bottom 0.813: C3.2 IC2.13 67.85,69.85 69.85,71.85 Q1.1
XTAL2
  Bottom 0.813: C4.2 IC2.12 Q1.2

### Text on the board
Bottom: +24912324940 | +249912204253